# EAGLE design FireLamp_WeMosD1Mini_Shield_1.0 (EAGLE 7.6.0)
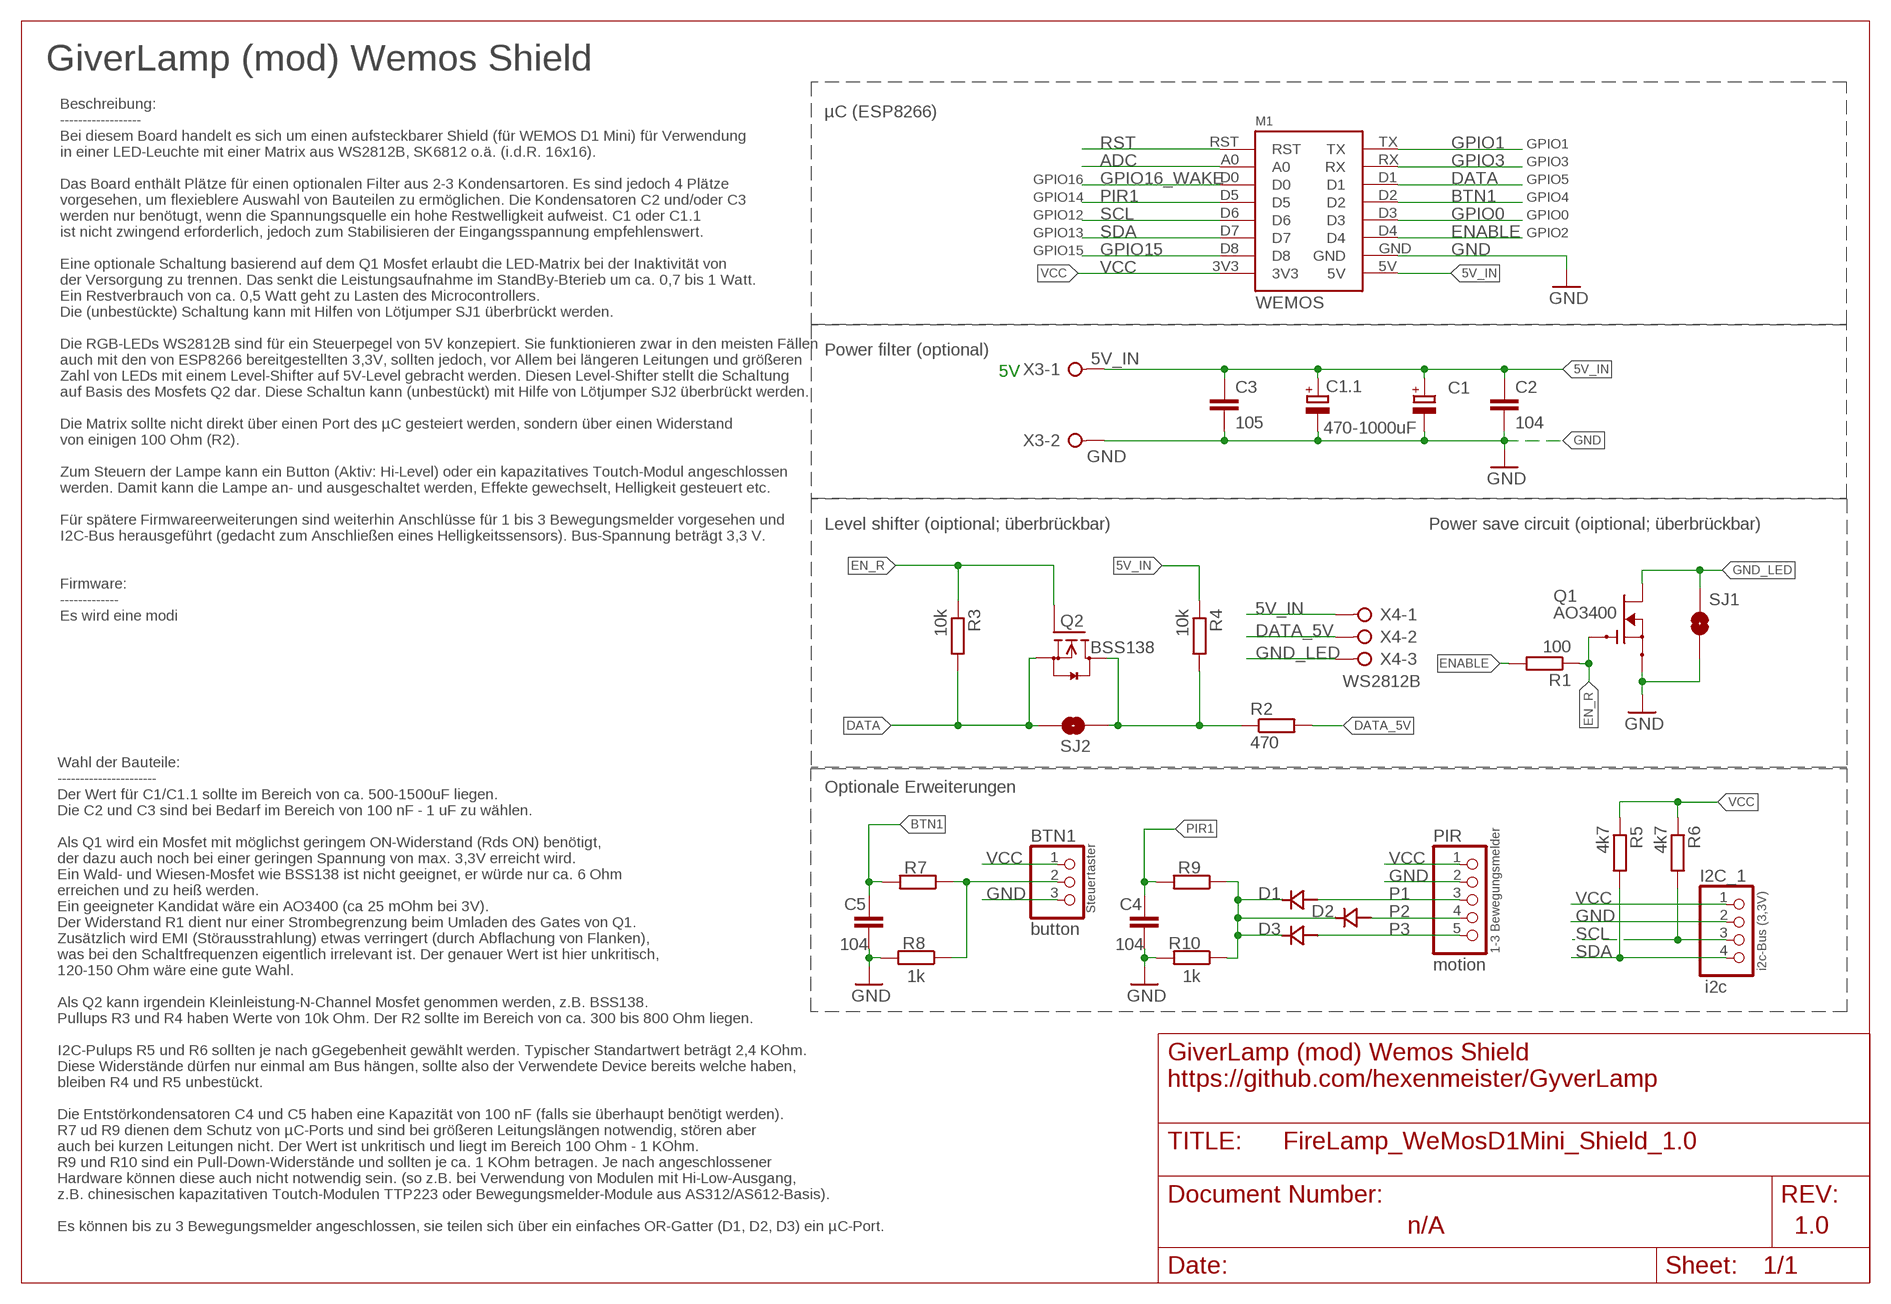
[diagram p0: schematic, sheet 1]

## Parts
BTN1  button  PINHD-1X3_S  [1X03]
C1  470-1000uF  CPOL-EUE2,5-6E  [E2,5-6E]
C1.1  CPOL-EU140CLH-1010  [140CLH-1010]
C2  104  C-EUC0805  [C0805]
C3  105  C  [MY1210]
C4  104  C-EUC0805  [C0805]
C5  104  C-EUC0805  [C0805]
D1  SS14  [DO214]
D2  SS14  [DO214]
D3  SS14  [DO214]
I2C_1  i2c  PINHD-1X4_S  [1X04]
M1  WEMOS  [WEMOS]
PIR  motion  PINHD-1X5_S  [1X05]
Q1  AO3400  [SOT23]
Q2  BSS138  [SOT23]
R1  100  R-EU_R0805  [R0805]
R2  470  R-EU_R0805  [R0805]
R3  10k  R-EU_R0805  [R0805]
R4  10k  R-EU_R0805  [R0805]
R5  4k7  R-EU_R0805  [R0805]
R6  4k7  R-EU_R0805  [R0805]
R7  100  R0805_SMALL_GAP  [R0805_SMALL_GAP]
R8  1k  R-EU_R0805  [R0805]
R9  100  R0805_SMALL_GAP  [R0805_SMALL_GAP]
R10  1k  R-EU_R0805  [R0805]
SJ1  pwr sv  JUMPER-PAD-2-NOYES_SILK  [PAD-JUMPER-2-NO_YES_SILK]
SJ2  lvl sh  JUMPER-PAD-2-NOYES_SILK  [PAD-JUMPER-2-NO_YES_SILK]
X3  W237-02P  [W237-132]
X4  W237-03P  [W237-133]

## Nets
5V_IN: C1.1.+ C1.+ C2.1 C3.1 M1.5V R4.1 X3.1 X4.1
ADC: M1.A0
BTN1: C5.1 M1.D2 R7.2
DATA: M1.D1 Q2.2(S) R3.2 SJ2.1
DATA_5V: R2.2 X4.2
EN_R: Q1.1(G) Q2.1(G) R1.1 R3.1
ENABLE: M1.D4 R1.2
GND: BTN1.3 C1.1.- C1.- C2.2 C3.2 C4.2 C5.2 I2C_1.2 M1.GND PIR.2 Q1.2(S) R8.2 R10.2 SJ1.2 X3.2
GND_LED: Q1.3(D) SJ1.1 X4.3
GPIO0: M1.D3
GPIO1: M1.TX
GPIO3: M1.RX
GPIO15: M1.D8
GPIO16_WAKE: M1.D0
N$5: D1.CATHODE D2.CATHODE D3.CATHODE R9.1 R10.1
N$7: BTN1.2 R7.1 R8.1
N$9: Q2.3(D) R2.1 R4.2 SJ2.2
P1: D1.ANODE PIR.3
P2: D2.ANODE PIR.4
P3: D3.ANODE PIR.5
PIR1: C4.1 M1.D5 R9.2
RST: M1.RST
SCL: I2C_1.3 M1.D6 R6.2
SDA: I2C_1.4 M1.D7 R5.2
VCC: BTN1.1 I2C_1.1 M1.3V3 PIR.1 R5.1 R6.1

## Notes on the sheet
- GiverLamp (mod) Wemos Shield
- Beschreibung:
  ------------------
  Bei diesem Board handelt es sich um einen aufsteckbarer Shield (für WEMOS D1 Mini) für Verwendung 
  in einer LED-Leuchte mit einer Matrix aus WS2812B, SK6812 o.ä. (i.d.R. 16x16).
  
  Das Board enthält Plätze für einen optionalen Filter aus 2-3 Kondensartoren. Es sind jedoch 4 Plätze 
  vorgesehen, um flexieblere Auswahl von Bauteilen zu ermöglichen. Die Kondensatoren C2 und/oder C3 
  werden nur benötugt, wenn die Spannungsquelle ein hohe Restwelligkeit aufweist. C1 oder C1.1  
  ist nicht zwingend erforderlich, jedoch zum Stabilisieren der Eingangsspannung empfehlenswert.
  
  Eine optionale Schaltung basierend auf dem Q1 Mosfet erlaubt die LED-Matrix bei der Inaktivität von 
  der Versorgung zu trennen. Das senkt die Leistungsaufnahme im StandBy-Bterieb um ca. 0,7 bis 1 Watt. 
  Ein Restverbrauch von ca. 0,5 Watt geht zu Lasten des Microcontrollers. 
  Die (unbestückte) Schaltung kann mit Hilfen von Lötjumper SJ1 überbrückt werden.
  
  Die RGB-LEDs WS2812B sind für ein Steuerpegel von 5V konzepiert. Sie funktionieren zwar in den meisten Fällen 
  auch mit den von ESP8266 bereitgestellten 3,3V, sollten jedoch, vor Allem bei längeren Leitungen und größeren 
  Zahl von LEDs mit einem Level-Shifter auf 5V-Level gebracht werden. Diesen Level-Shifter stellt die Schaltung 
  auf Basis des Mosfets Q2 dar. Diese Schaltun kann (unbestückt) mit Hilfe von Lötjumper SJ2 überbrückt werden.
  
  Die Matrix sollte nicht direkt über einen Port des µC gesteiert werden, sondern über einen Widerstand 
  von einigen 100 Ohm (R2).
  
  Zum Steuern der Lampe kann ein Button (Aktiv: Hi-Level) oder ein kapazitatives Toutch-Modul angeschlossen 
  werden. Damit kann die Lampe an- und ausgeschaltet werden, Effekte gewechselt, Helligkeit gesteuert etc.
  
  Für spätere Firmwareerweiterungen sind weiterhin Anschlüsse für 1 bis 3 Bewegungsmelder vorgesehen und 
  I2C-Bus herausgeführt (gedacht zum Anschließen eines Helligkeitssensors). Bus-Spannung beträgt 3,3 V. 
  
  
  Firmware: 
  -------------
  Es wird eine modifizierte Version der Firmware verwendet: Data-PIN 
  wurde auf GPIO5 verlegt, GPIO2 wird zum Abschalten der Matrix bei 
  Inaktivität verwendet.
  
  https://github.com/hexenmeister/GyverLamp
- µC (ESP8266)
- GPIO1
- GPIO3
- GPIO16 | GPIO5
- GPIO14 | GPIO4
- GPIO12 | GPIO0
- GPIO13 | GPIO2
- GPIO15
- Power filter (optional)
- 5V
- Level shifter (oiptional; überbrückbar) | Power save circuit (oiptional; überbrückbar)
- WS2812B
- Wahl der Bauteile:
  ----------------------
  Der Wert für C1/C1.1 sollte im Bereich von ca. 500-1500uF liegen.
  Die C2 und C3 sind bei Bedarf im Bereich von 100 nF - 1 uF zu wählen.
  
  Als Q1 wird ein Mosfet mit möglichst geringem ON-Widerstand (Rds ON) benötigt, 
  der dazu auch noch bei einer geringen Spannung von max. 3,3V erreicht wird. 
  Ein Wald- und Wiesen-Mosfet wie BSS138 ist nicht geeignet, er würde nur ca. 6 Ohm 
  erreichen und zu heiß werden. 
  Ein geeigneter Kandidat wäre ein AO3400 (ca 25 mOhm bei 3V).
  Der Widerstand R1 dient nur einer Strombegrenzung beim Umladen des Gates von Q1.
  Zusätzlich wird EMI (Störausstrahlung) etwas verringert (durch Abflachung von Flanken), 
  was bei den Schaltfrequenzen eigentlich irrelevant ist. Der genauer Wert ist hier unkritisch, 
  120-150 Ohm wäre eine gute Wahl. 
  
  Als Q2 kann irgendein Kleinleistung-N-Channel Mosfet genommen werden, z.B. BSS138.
  Pullups R3 und R4 haben Werte von 10k Ohm. Der R2 sollte im Bereich von ca. 300 bis 800 Ohm liegen.
  
  I2C-Pulups R5 und R6 sollten je nach gGegebenheit gewählt werden. Typischer Standartwert beträgt 2,4 KOhm.
  Diese Widerstände dürfen nur einmal am Bus hängen, sollte also der Verwendete Device bereits welche haben, 
  bleiben R4 und R5 unbestückt.
  
  Die Entstörkondensatoren C4 und C5 haben eine Kapazität von 100 nF (falls sie überhaupt benötigt werden). 
  R7 ud R9 dienen dem Schutz von µC-Ports und sind bei größeren Leitungslängen notwendig, stören aber 
  auch bei kurzen Leitungen nicht. Der Wert ist unkritisch und liegt im Bereich 100 Ohm - 1 KOhm.
  R9 und R10 sind ein Pull-Down-Widerstände und sollten je ca. 1 KOhm betragen. Je nach angeschlossener
  Hardware können diese auch nicht notwendig sein. (so z.B. bei Verwendung von Modulen mit Hi-Low-Ausgang, 
  z.B. chinesischen kapazitativen Toutch-Modulen TTP223 oder Bewegungsmelder-Module aus AS312/AS612-Basis).
  
  Es können bis zu 3 Bewegungsmelder angeschlossen, sie teilen sich über ein einfaches OR-Gatter (D1, D2, D3) ein µC-Port.
- Optionale Erweiterungen
- Steuertaster
- 1-3 Bewegungsmelder
- i2c-Bus (3,3V)
- GiverLamp (mod) Wemos Shield
  https://github.com/hexenmeister/GyverLamp
- n/A | 1.0

## Library data of the parts
BTN1 = my:PINHD-1X3_S: PIN HEADER
C1 C1.1 = rcl:CPOL-EU: POLARIZED CAPACITOR, European symbol
C2 C4 C5 = resistor:C-EU: CAPACITOR, European symbol
C3 = my:C: CAPACITOR, European symbol
D1-D3 = ihpcb-diode:SS14
I2C_1 = my:PINHD-1X4_S: PIN HEADER
M1 = 1455413453956-wemos:WEMOS
PIR = my:PINHD-1X5_S: PIN HEADER
Q1 = AO3400:AO3400; AVAILABILITY: Unavailable; DESCRIPTION: N-Channel 30V 5.7A _Ta_ 1.4W _Ta_ Surface Mount SOT-23-3L; MF: Alpha &; MP: AO3400; PACKAGE: SOT-23-3 Alpha &amp; Omega Semiconductor; PRICE: None
Q2 = my:BSS138: Fairchild Semiconductors BSS138 N-Channel Logic Level Enhancement Mode Field Effect Transistor General Description: These N-Channel enhancement mode field effect transistors are produced using Fairchild's proprietary, high cell density, DMOS technology. These products have been designed to minimize on-state resistance while provide rugged, reliable, and fast switching performance.These products are particularly suited for low voltage, low current applications such as small servo motor control, power MOSFET gate drivers, and other switching applications. Features: 0.22 A, 50 V. RDS(ON) = 3.5Ohm @ VGS = 10 V RDS(ON) = 6.0Ohm @ VGS = 4.5 V High density cell design for extremely low RDS(ON) Rugged and Reliable Compact industry standard SOT-23 surface mount package Please send any comments to: messi@users.sourceforge.net
R1-R6 R8 R10 = resistor:R-EU_: RESISTOR, European symbol
R7 R9 = my:R0805_SMALL_GAP: SMD Resistor (0805) mit einer schmalleren Lücke (kann als Lötjumper erwendet werden)
SJ1 SJ2 = SparkFun-Passives:JUMPER-PAD-2-NO
X3 = con-wago-508:W237-02P: WAGO SREW CLAMP; OC_FARNELL: unknown; OC_NEWARK: unknown
X4 = con-wago-508:W237-03P: WAGO SREW CLAMP; OC_FARNELL: unknown; OC_NEWARK: unknown

## Board
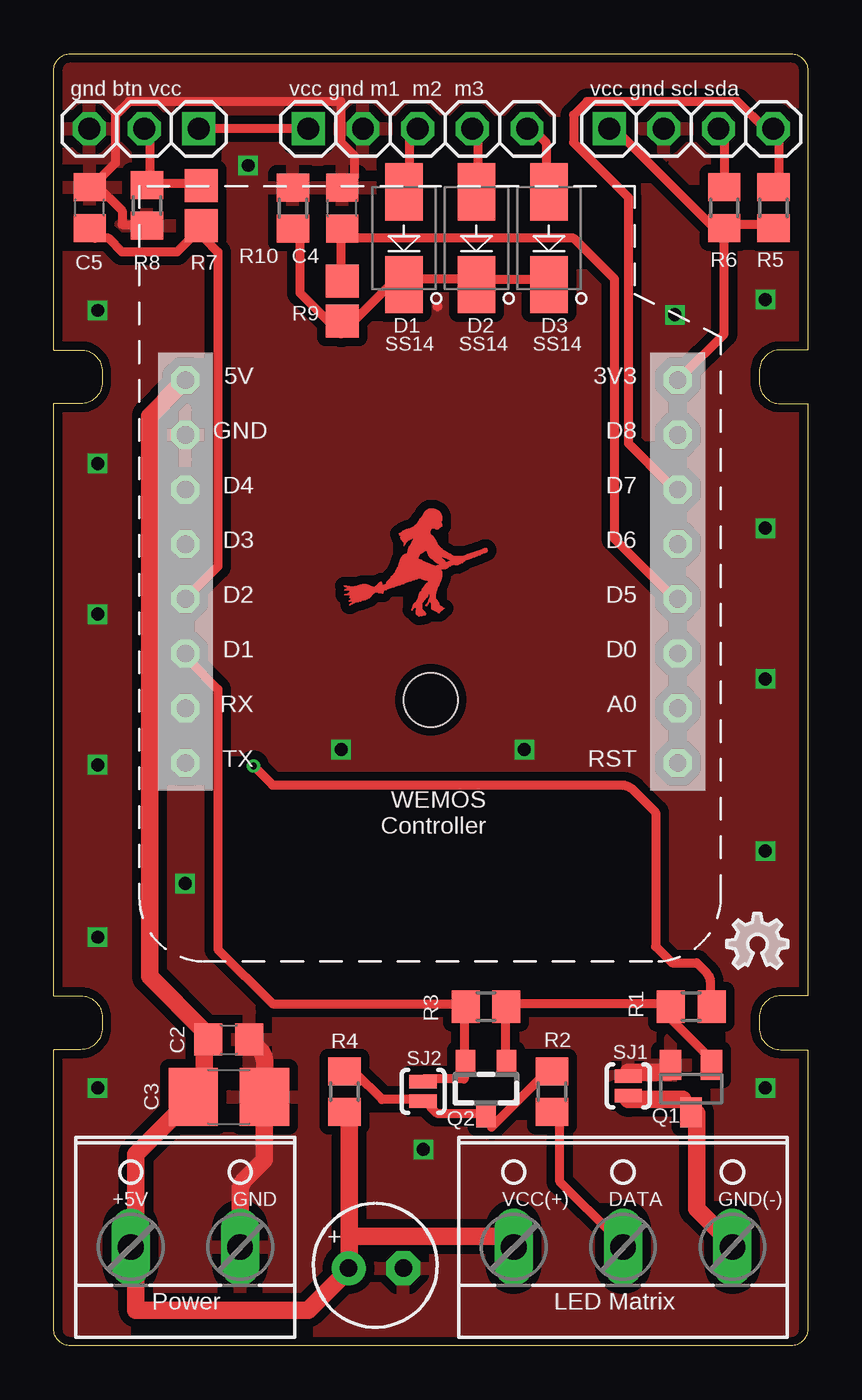
[diagram p1: board, top side]
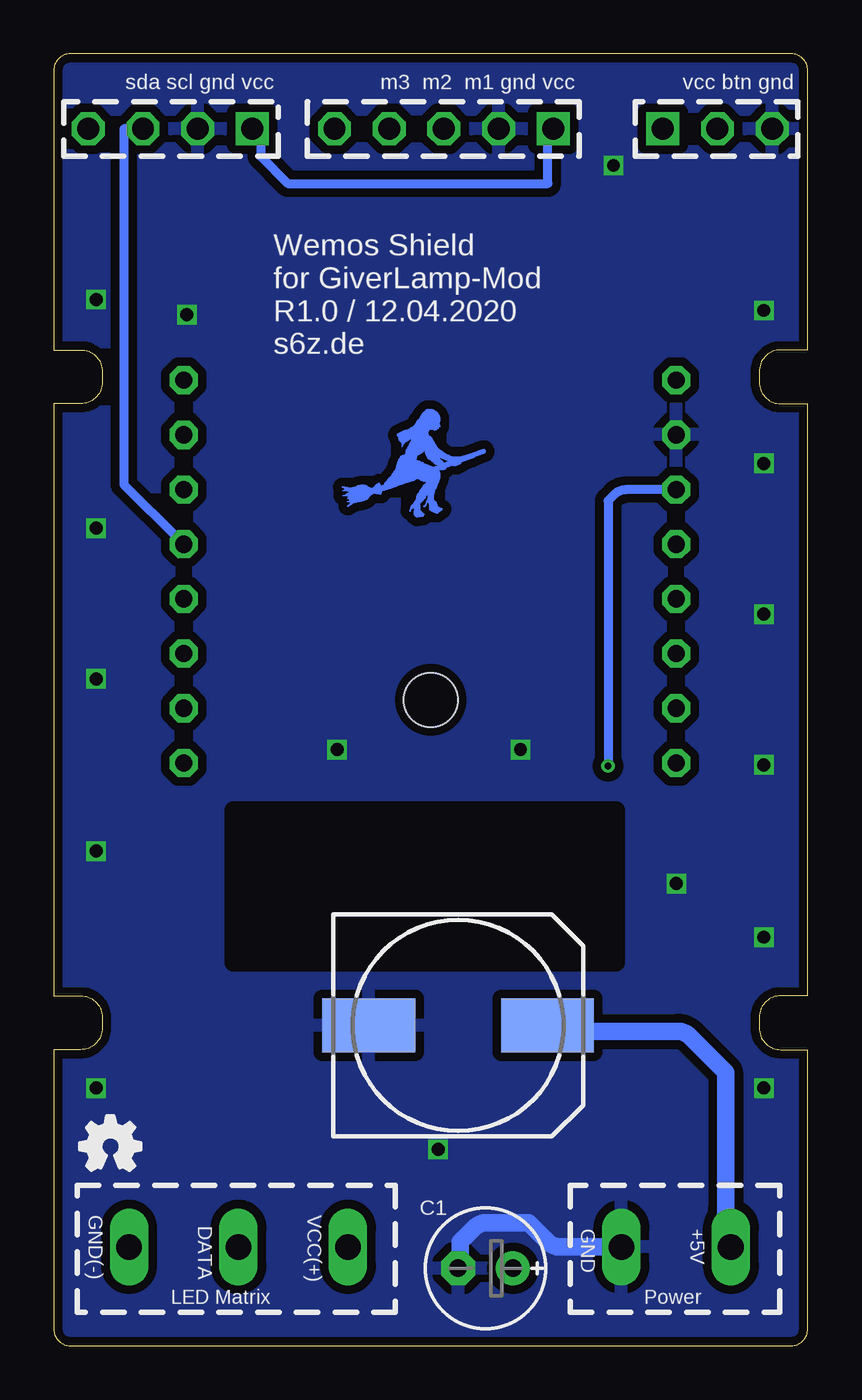
[diagram p2: board, bottom side, seen from below]

Size 35 x 60 mm. Coordinates in mm from the lower left corner, seen from the top.
Outline: 34.24,0 0.76,0 arc-90 0,0.76 0,13.75 1.25,13.75 arc90 2.25,14.75 2.25,15.25 arc90 1.25,16.25 0,16.25 0,43.75 1.25,43.75 arc90 2.25,44.75 2.25,45.25 arc90 1.25,46.25 0,46.25 0,59.24 arc-90 0.76,60 34.24,60 arc-90 35,59.24 35,46.25 33.75,46.25 arc90 32.75,45.25 32.75,44.75 arc90 33.75,43.75 35,43.75 35,16.25 33.75,16.25 arc90 32.75,15.25 32.75,14.75 arc90 33.75,13.75 35,13.75 35,0.76 arc-90 34.24,0
Copper layers (1*16): Top 0.035mm / dielectric 1.5mm / Bottom 0.035mm
Design rules "ITEADstudio_DRC *": minimum track width 16mil, minimum drill 12mil, track to track 6mil, track to pad 10mil, pad to pad 6mil, via to via 6mil, smd to smd 0mil, copper to edge 10mil, drill to drill 10mil, minimum pad ring 10mil, minimum via ring 6mil, stop-mask expansion 2mil, vias tented up to drill 100mil, thermal gap 16mil
Holes 2.5 mm at 17.5,30
tRestrict: area 8.9,17.8 to 26.7,24.9
bRestrict: area 8.9,17.8 to 26.7,24.9

### Footprints (pad centres in the part's own frame; a part is rotated, then mirrored left to right if it is on the bottom)
1X03 = drill 1.016 square: 1 -2.54,0 | drill 1.016 octagon: 2 0,0; 3 2.54,0
E2,5-6E = drill 0.813 pad 1.575: + -1.27,0 | drill 0.813 pad 1.575 octagon: - 1.27,0
140CLH-1010 = smd 4.3 x 2.5: + 4.15,0; - -4.15,0
C0805 = smd 1.3 x 1.5: 1 -0.95,0; 2 0.95,0
MY1210 = smd 2.286 x 2.7: 1 -1.654,0; 2 1.654,0
DO214 = smd 2.65 x 1.75: ANODE -2.15,0; CATHODE 2.15,0
1X04 = drill 1.016 square: 1 -3.81,0 | drill 1.016 octagon: 2 -1.27,0; 3 1.27,0; 4 3.81,0
WEMOS = drill 0.8 octagon: 3V3 0,0; 5V 22.86,0; A0 0,15.24; D0 0,12.7; D1 22.86,12.7; D2 22.86,10.16; D3 22.86,7.62; D4 22.86,5.08; D5 0,10.16; D6 0,7.62; D7 0,5.08; D8 0,2.54; GND 22.86,2.54; RST 0,17.78; RX 22.86,15.24; TX 22.86,17.78
1X05 = drill 1.016 square: 1 -5.08,0 | drill 1.016 octagon: 2 -2.54,0; 3 0,0; 4 2.54,0; 5 5.08,0
SOT23 = smd 1 x 1.4: 1 -0.95,-1.1; 2 0.95,-1.1; 3 0,1.1
SOT23' = smd 0.9 x 1.2: 1 -0.95,-1.2; 2 0.95,-1.2; 3 0,1.2
R0805 = smd 1.3 x 1.5: 1 -0.95,0; 2 0.95,0
R0805_SMALL_GAP = smd 1.524 x 1.524: 1 -0.927,0; 2 0.927,0
PAD-JUMPER-2-NO_YES_SILK = smd 0.635 x 1.27: 1 -0.45,0; 2 0.45,0
W237-132 = drill 1.194 long: 1 -2.54,-0.635; 2 2.54,-0.635
W237-133 = drill 1.194 long: 1 -5.08,-0.635; 2 0,-0.635; 3 5.08,-0.635

### Placement (x,y rotation side)
BTN1  4.19,56.52 180 top
C1  14.96,3.6 180 bottom
C1.1  16.23,14.87 0 bottom
C2  8.13,14.22 0 top
C3  8.13,11.56 0 top
C4  13.39,52.83 90 top
C5  1.66,52.85 90 top
D1  16.26,51.44 270 top
D2  19.62,51.44 270 top
D3  22.99,51.44 270 top
I2C_1  29.59,56.52 0 top
M1  28.97,44.84 180 top
PIR  16.89,56.52 0 top
Q1  29.59,11.94 180 top
Q2  BSS138  [SOT23']  20.07,11.94 180 top
R1  29.59,15.75 0 top
R2  23.13,11.8 270 top
R3  20.07,15.75 180 top
R4  13.5,11.8 90 top
R5  33.41,52.85 90 top
R6  31.13,52.85 90 top
R7  6.85,52.95 270 top
R8  4.32,52.96 270 top
R9  13.39,48.51 90 top
R10  11.1,52.83 90 top
SJ1  26.67,12.06 90 top
SJ2  17.14,11.81 270 top
U$1  [OSHW_FILLX100_NOTEXT]  33.79,8.14 0 bottom
U$2  [OSHW_FILLX100_NOTEXT]  31.25,17.53 0 top
X3  6.11,5.22 0 top
X4  26.43,5.22 0 top

### Tracks (layer width: path | path; a pad name or v marks a point on that pad's centre or on a via)
5V_IN
  Top 0.406: 13.72,10.79 R4.1 | 6.99,13.97 C2.1 6.99,14.61 | 6.99,12.06 C3.1 6.35,11.43
  Top 0.813: 13.72,3.56 13.72,5.08 | 13.72,3.56 11.81,1.65 3.81,1.65 3.81,5.08 | 13.72,5.08 13.72,10.79 | 13.72,3.56 C1.+ | 13.72,5.08 20.95,5.08 X4.1 | 6.99,12.06 6.99,13.97 | 6.99,14.61 4.45,17.14 4.45,43.18 5.71,44.45 M1.5V | 3.81,5.08 3.81,8.89 6.35,11.43 | 3.81,5.08 X3.1
  Bottom 0.406: 12.06,14.61 C1.1.+
  Bottom 0.813: 3.81,6.35 3.81,5.08 X3.1 3.59,4.61 arc45 3.81,5.14 3.81,12.7 5.49,14.38 arc-45 6.03,14.61 12.06,14.61
BTN1
  Top 0.406: C5.1 1.91,51.44 2.54,51.44 3.17,50.8 5.71,50.8 6.35,51.44 R7.2 6.99,51.44 7.62,50.8 7.62,36.2 6.35,34.92 M1.D2
DATA
  Top 0.406: M1.D1 6.35,31.75 7.62,30.48 7.62,18.41 10.16,15.88 19.05,15.88 R3.2 19.05,15.24 19.05,13.34 Q2.2 19.05,13.02 19.05,12.38 17.14,12.38 SJ2.1
DATA_5V
  Top 0.406: R2.2 23.5,10.79 23.5,7.62 26.04,5.08 X4.2
EN_R
  Top 0.406: Q2.1 20.95,13.34 20.95,15.24 R3.1 21.59,15.88 28.57,15.88 R1.1 28.57,15.24 30.48,13.34 Q1.1
ENABLE  (via drill 0.3)
  Top 0.406: v9.27,26.92 10.16,26.04 26.35,26.04 arc-45 26.89,25.81 27.94,24.77 27.94,18.54 28.7,17.78 29.84,17.78 30.26,17.37 arc-45 30.48,16.83 30.48,15.88 R1.2
  Bottom 0.406: v9.27,26.92 9.27,39.24 8.99,39.53 arc45 8.45,39.75 6.35,39.75 M1.D4
GND  (via drill 0.6)
  Top 0.406: 28.57,12.7 Q1.2 | 26.67,12.7 SJ1.2 | 1.91,53.98 3.17,52.7 3.17,52.07 4.13,52.07 R8.2 | 1.91,53.98 2.86,54.93 2.86,57.15 3.49,57.78 13.34,57.78 13.34,55.88 13.97,55.24 13.97,54.29 13.65,53.98 13.41,53.98 | 1.91,53.98 C5.2 | 17.78,48.26 17.84,48.26
  Top 0.813: 26.67,12.7 28.57,12.7 | C2.2 9.56,13.74 arc-45 9.78,13.2 C3.2 arc45 C3.2 9.78,8.64 8.87,7.73 arc45 8.65,7.19 X3.2
  Bottom 0.813: X3.2 11.51,4.59 arc45 12.05,4.81 12.95,5.71 14.92,5.71 arc-45 15.46,5.49 16.13,4.83 16.13,3.84 arc45 C1.-
  other vias: 2.03,48.08 6.1,21.46 28.83,47.88 2.03,40.97 2.03,33.97 2.03,26.97 2.03,18.97 2.03,11.97 33.03,48.59 33.03,37.97 33.03,30.97 33.03,22.97 33.03,11.97 17.16,9.12 13.34,27.69 21.84,27.69 9.02,54.81
  pour Top (isolate 0.406): 0,60.47 35.95,60.47 35.95,-0.18 0,-0.18
  pour Bottom (isolate 0.406): 0,60.47 35.57,60.47 35.57,0.14 0,0.14
GND_LED
  Top 0.406: 26.67,11.43 SJ1.1 | 29.21,11.43 Q1.3 29.84,10.79
  Top 0.813: 29.21,11.43 26.67,11.43 | 29.84,10.79 29.84,6.35 31.11,5.08 X4.3
N$5
  Top 0.406: R10.1 11.43,51.44 11.43,48.9 13.34,46.99 R9.1 13.97,47.62 15.88,49.53 D1.CATHODE 16.51,49.53 19.05,49.53 D2.CATHODE 19.68,49.53 22.86,49.53 D3.CATHODE
N$7
  Top 0.406: 4.45,53.98 6.35,53.98 R7.1 | 4.45,53.98 4.45,56.52 BTN1.2 | 4.45,53.98 R8.1
N$9
  Top 0.406: 17.14,11.43 17.78,10.79 19.68,10.79 Q2.3 20.32,10.16 22.86,12.7 R2.1 | 17.14,11.43 15.24,11.43 13.97,12.7 R4.2 | 17.14,11.43 SJ2.2
P1
  Top 0.406: D1.ANODE 16.51,53.98 16.51,56.52 PIR.3
P2
  Top 0.406: D2.ANODE 19.68,53.98 19.68,56.52 PIR.4
P3
  Top 0.406: D3.ANODE 22.86,53.98 22.86,55.88 22.23,56.52 PIR.5
PIR1
  Top 0.406: R9.2 13.34,49.53 13.34,51.44 C4.1 13.97,51.44 24.13,51.44 26.04,49.53 26.04,37.47 28.57,34.92 M1.D5
SCL
  Top 0.406: R6.2 31.11,53.98 31.11,56.52 I2C_1.3
  Bottom 0.406: I2C_1.3 31.75,56.52 31.75,40.01 29.21,37.47 M1.D6
SDA
  Top 0.406: R5.2 33.66,53.98 33.66,56.52 I2C_1.4 33.02,56.52 31.75,57.78 24.77,57.78 24.13,57.15 24.13,55.88 26.67,53.34 26.67,41.91 28.57,40.01 M1.D7
VCC
  Top 0.406: PIR.1 BTN1.1 | R5.1 33.02,52.07 31.75,52.07 R6.1 31.11,51.44 | 31.11,51.44 31.11,46.99 29.21,45.09 M1.3V3 | 31.11,51.44 26.04,56.52 I2C_1.1
  Bottom 0.406: PIR.1 12.06,56.52 12.06,53.98 24.13,53.98 25.4,55.24 25.4,56.52 I2C_1.1
(copper drawn outside any net)
  shapes: Bottom area x390, Top area x390

### Text on the board
tPlace: gnd btn vcc | vcc gnd m1 m2 m3 | vcc gnd scl sda | +5V | GND | VCC(+) | DATA | GND(-) | + | Power | LED Matrix
bPlace: vcc btn gnd | m3 m2 m1 gnd vcc | sda scl gnd vcc | Wemos Shield / for GiverLamp-Mod / R1.0 / 12.04.2020 / s6z.de | VCC(+) | DATA | GND(-) | +5V | GND | Power | LED Matrix
tStop: Wemos Shield / for GiverLamp-Mod / R1.0 / 12.04.2020 / s6z.de